# Altium schematic sheet Skjema.SchDoc: Power Distrubution Board
size A3; Author: Iver Andreas Ugelvik; CompanyName: VORTEX NTNU
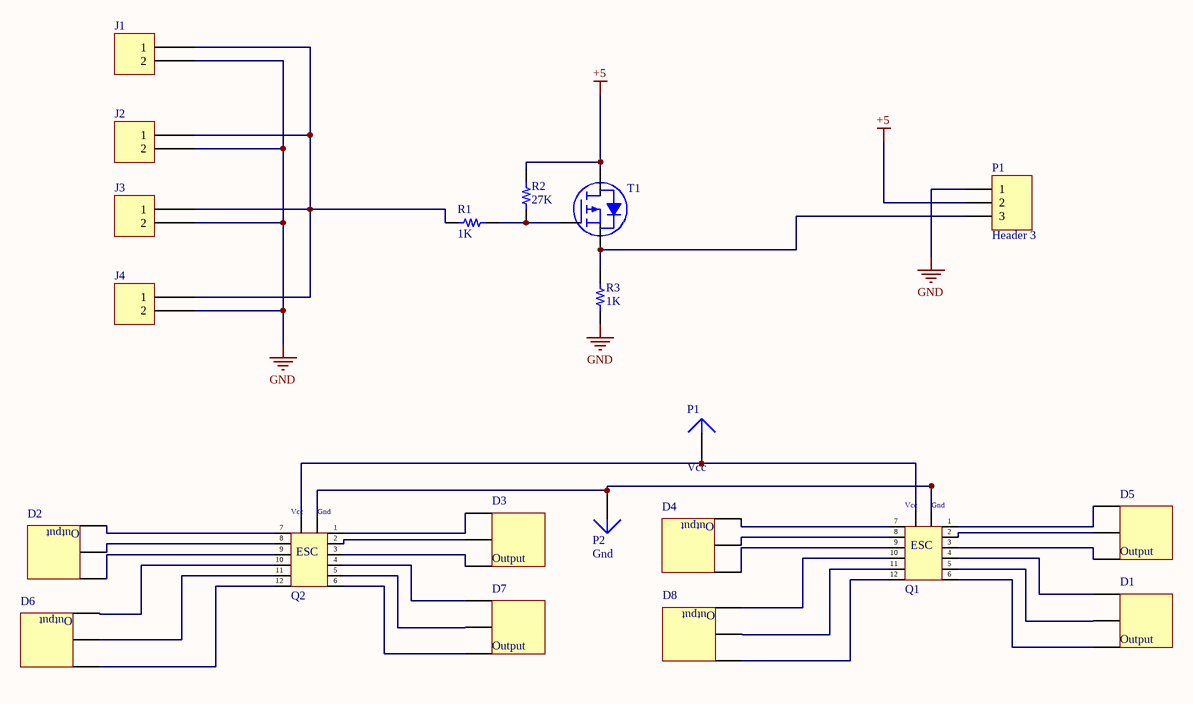
[diagram p0: Skjema.SchDoc]

## Parts
(Parts that share a designator on the sheet are numbered #1, #2 ... from top to bottom, then left to right.)
D1  (no value)  [JST_B3PS-VH(LF)(SN)]
D2  (no value)  [JST_B3PS-VH(LF)(SN)]
D3  (no value)  [JST_B3PS-VH(LF)(SN)]
D4  (no value)  [JST_B3PS-VH(LF)(SN)]
D5  (no value)  [JST_B3PS-VH(LF)(SN)]
D6  (no value)  [JST_B3PS-VH(LF)(SN)]
D7  (no value)  [JST_B3PS-VH(LF)(SN)]
D8  (no value)  [JST_B3PS-VH(LF)(SN)]
J1  BM02B-GHS-TBT(LF)(SN)(N)  [JST BM02B-GHS-TBT]  (value not drawn)
J2  BM02B-GHS-TBT(LF)(SN)(N)  [JST BM02B-GHS-TBT]  (value not drawn)
J3  BM02B-GHS-TBT(LF)(SN)(N)  [JST BM02B-GHS-TBT]  (value not drawn)
J4  BM02B-GHS-TBT(LF)(SN)(N)  [JST BM02B-GHS-TBT]  (value not drawn)
P1#1  Header 3  [HDR1X3]
P1#2  Vcc  [PIN1]
P2  Gnd  [PIN1]
Q1  ESC for Vortex  [ESC - Org]  (value not drawn)
Q2  ESC for Vortex  [ESC - Org]  (value not drawn)
R1  1K  [RES 0805/2012]
R2  27K  [RES 0805/2012]
R3  1K  [RES 0805/2012]
T1  1  [INFINEON SOT-23-3]  (value not drawn)

## Nets
+5: P1#1.2 R2.2 T1.2(D)
GND: J1.2 J2.2 J3.2 J4.2 P1#1.1 R3.1
NetD1_22: D1.22 Q1.4
NetD1_23: D1.23 Q1.5
NetD1_24: D1.24 Q1.6
NetD2_22: D2.22 Q2.9
NetD2_23: D2.23 Q2.8
NetD2_24: D2.24 Q2.7
NetD3_22: D3.22 Q2.1
NetD3_23: D3.23 Q2.2
NetD3_24: D3.24 Q2.3
NetD4_22: D4.22 Q1.9
NetD4_23: D4.23 Q1.8
NetD4_24: D4.24 Q1.7
NetD5_22: D5.22 Q1.1
NetD5_23: D5.23 Q1.2
NetD5_24: D5.24 Q1.3
NetD6_22: D6.22 Q2.12
NetD6_23: D6.23 Q2.11
NetD6_24: D6.24 Q2.10
NetD7_22: D7.22 Q2.4
NetD7_23: D7.23 Q2.5
NetD7_24: D7.24 Q2.6
NetD8_22: D8.22 Q1.12
NetD8_23: D8.23 Q1.11
NetD8_24: D8.24 Q1.10
NetJ1_1: J1.1 J2.1 J3.1 J4.1 R1.1
NetP1#1_3: P1#1.3 R3.2 T1.3(S)
NetP1#2_1: P1#2.1 Q1.13(Vcc) Q2.13(Vcc)
NetP2_1: P2.1 Q1.14(Gnd) Q2.14(Gnd)
NetR1_2: R1.2 R2.1 T1.1(G)

## Notes on the sheet
- Title
- Size
- Author
- Rev
- A3
- Sheet no.
- of
- (in symbol Connect?) Output

## Library data of the parts
D1-D8 = Connect?
J1-J4 = BM02B-GHS-TBT(LF)(SN)(N): CONN HEADER GH TOP 2POS 1.25MM; Manufacturer: JST Sales America Inc.; Pitch: 0.049" (1.25mm); Number Of Positions: 2; Part Number: BM02B-GHS-TBT(LF)(SN)(N); Colour: Natural; PartId: 7816; Supplier 1: Digi-Key; Supplier Part Number 1: 455-1578-2-ND; ComponentLink1Description: Datasheet; ComponentLink1URL: http://www.jst-mfg.com/product/pdf/eng/eGH.pdf; ComponentLink2Description: Digi-Key Listing; ComponentLink2URL: http://www.digikey.ca/product-detail/en/BM02B-GHS-TBT(LF)(SN)(N)/455-1578-2-ND/807800; Price: 0,2297; Type: Surface Mount; Contact Finish: Tin; Fastening Type: Locking Ramp; Number Of Rows: 1; Series: GH
P1#1 = Header 3: Header, 3-Pin; LatestRevisionDate: 17-Jul-2002; LatestRevisionNote: Re-released for DXP Platform.; Publisher: Altium Limited
P1#2 P2 = Plug: LatestRevisionDate: 17-Jul-2002; LatestRevisionNote: Re-released for DXP Platform.; Publisher: Altium Limited
Q1 Q2 = ESC
R1-R3 = RC0805JR-070RL: RES SMD 0.0 OHM JUMPER 1/8W 0805; Manufacturer: Yageo; Value: 0.0; TemperatureRange: -55C ~ 155C; PowerRating: 0.125W, 1/8W; Part Number: RC0805JR-070RL; PartId: 16144; Supplier 1: Digi-Key; Supplier Part Number 1: 311-0.0ARTR-ND; ComponentLink1Description: Datasheet; ComponentLink1URL: http://www.yageo.com/documents/recent/PYu-RC_Group_51_RoHS_L_04.pdf; ComponentLink2Description: Digi-Key Listing; ComponentLink2URL: https://www.digikey.com/product-detail/en/yageo/RC0805JR-070RL/311-0.0ARTR-ND/728216; Tolerance: Jumper; Price: 0,0031; Device Package: 0805 (2012 Metric)
T1 = BSS308PE H6327: MOSFET P-CH 30V 2A SOT23; Manufacturer: Infineon Technologies; Type: MOSFET P-Channel, Metal Oxide; Rds On (Max) at Id, Vgs: 80 mOhm @ 2A, 10V; Vgs(th) (Max) at Id: 1V @ 11uA; Gate Charge (Qg): 5nC @ 10V; Input Capacitance (Ciss) at Vds: 500pF @ 15V; Power - Max: 500mW; Current Continuous Drain: 2A (Ta); Part Number: BSS308PE H6327; PartId: 8163; Supplier 1: Digi-Key; Supplier Part Number 1: BSS308PE H6327TR-ND; ComponentLink1Description: Datasheet; ComponentLink1URL: http://www.infineon.com/dgdl/BSS308PE_Rev2.03.pdf?folderId=db3a304314dca38901154a72e3951a65&fileId=db3a304330f686060131099c80400073; ComponentLink2Description: Digi-Key Listing; ComponentLink2URL: http://www.digikey.com/product-detail/en/BSS308PE%20H6327/BSS308PE%20H6327TR-ND/2783466; Price: 0,0819; Device Package: TO-236-3, SC-59, SOT-23-3; Drain to Source Voltage (Vdss): 30V; Features: Logic Level Gate, 4.5V Drive